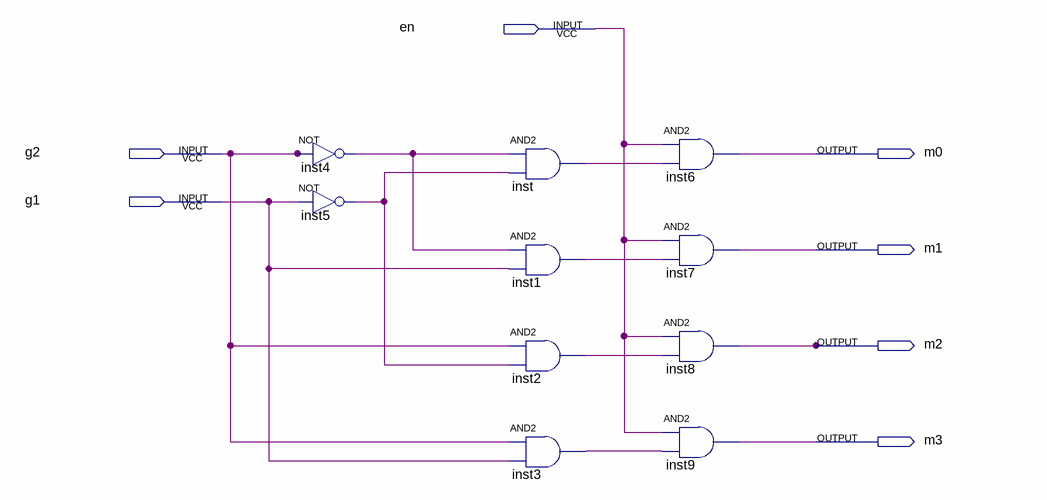
[diagram p0: schematic sheet]
// Quartus schematic decoder24.bdf as structural Verilog: 10 symbols, 7 pins
module decoder24 (
  input  en,
  input  g2,
  input  g1,
  output m0,
  output m1,
  output m2,
  output m3
);

  wire inst1_out, inst2_out, inst3_out, inst4_out, inst5_out, inst_out;

  not inst4 (inst4_out, g2);
  not inst5 (inst5_out, g1);
  and inst (inst_out, inst4_out, inst5_out);
  and inst1 (inst1_out, inst4_out, g1);
  and inst2 (inst2_out, g2, inst5_out);
  and inst3 (inst3_out, g2, g1);
  and inst6 (m0, en, inst_out);
  and inst7 (m1, en, inst1_out);
  and inst8 (m2, en, inst2_out);
  and inst9 (m3, en, inst3_out);
endmodule
